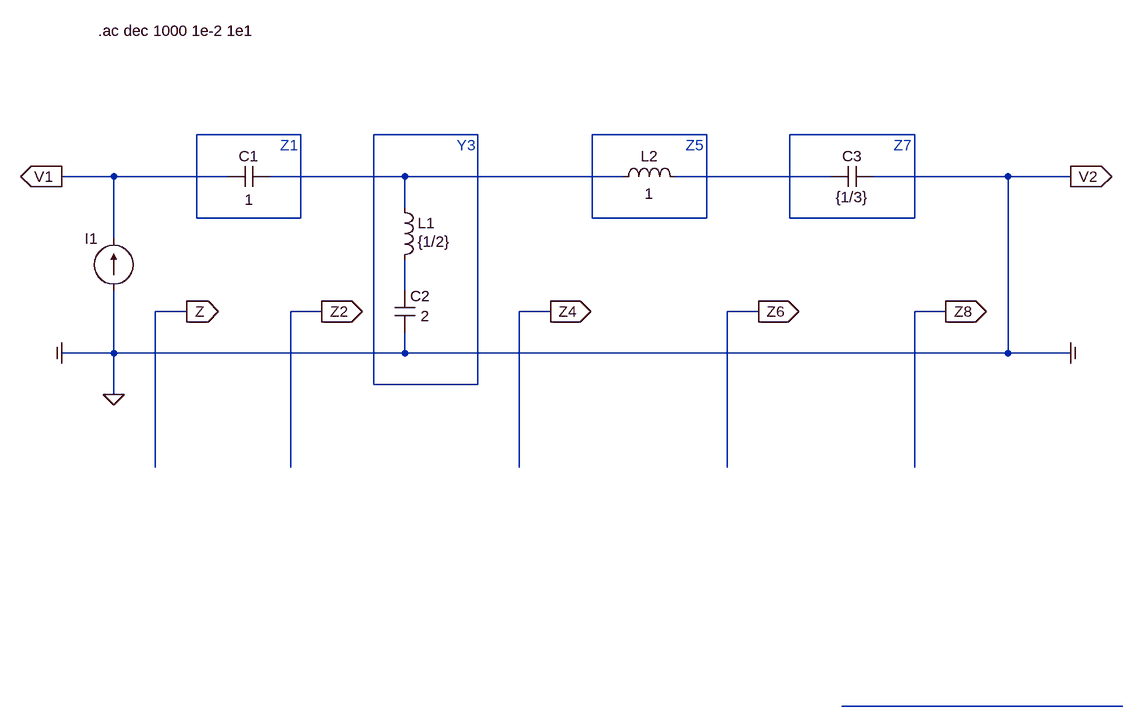
[diagram p0: schematic TS12_Ejercicio_1_LTSpice_Remociones.asc]
TS12_Ejercicio_1_LTSpice_Remociones.asc, the LTspice schematic file:
Version 4
SHEET 1 1344 680
WIRE -320 -240 -480 -240
WIRE -48 -240 -208 -240
WIRE 304 -240 128 -240
WIRE 624 -240 432 -240
WIRE -608 -176 -688 -176
WIRE -432 -176 -608 -176
WIRE -160 -176 -368 -176
WIRE 176 -176 -160 -176
WIRE 496 -176 256 -176
WIRE 768 -176 560 -176
WIRE 864 -176 768 -176
WIRE -160 -128 -160 -176
WIRE -480 -112 -480 -240
WIRE -320 -112 -320 -240
WIRE -320 -112 -480 -112
WIRE 128 -112 128 -240
WIRE 304 -112 304 -240
WIRE 304 -112 128 -112
WIRE 432 -112 432 -240
WIRE 624 -112 624 -240
WIRE 624 -112 432 -112
WIRE -608 -80 -608 -176
WIRE -160 0 -160 -48
WIRE -496 32 -544 32
WIRE -288 32 -336 32
WIRE 64 32 16 32
WIRE 384 32 336 32
WIRE 672 32 624 32
WIRE -608 96 -608 0
WIRE -608 96 -688 96
WIRE -160 96 -160 64
WIRE -160 96 -608 96
WIRE 768 96 768 -176
WIRE 768 96 -160 96
WIRE 864 96 768 96
WIRE -208 144 -208 -240
WIRE -48 144 -48 -240
WIRE -48 144 -208 144
WIRE -608 160 -608 96
WIRE -544 272 -544 32
WIRE -336 272 -336 32
WIRE 16 272 16 32
WIRE 336 272 336 32
WIRE 624 272 624 32
WIRE 944 640 512 640
FLAG 864 -176 V2
IOPIN 864 -176 Out
FLAG -688 -176 V1
IOPIN -688 -176 Out
FLAG -608 160 0
FLAG -688 96 COM
IOPIN -688 96 Out
FLAG 864 96 COM
IOPIN 864 96 Out
FLAG -496 32 Z
IOPIN -496 32 Out
FLAG -288 32 Z2
IOPIN -288 32 Out
FLAG 64 32 Z4
IOPIN 64 32 Out
FLAG 384 32 Z6
IOPIN 384 32 Out
FLAG 672 32 Z8
IOPIN 672 32 Out
SYMBOL cap -368 -192 R90
WINDOW 0 0 32 VBottom 2
WINDOW 3 67 32 VBottom 2
SYMATTR InstName C1
SYMATTR Value 1
SYMBOL cap -176 0 R0
WINDOW 3 40 39 Left 2
SYMATTR Value 2
SYMATTR InstName C2
SYMBOL ind -176 -144 R0
WINDOW 3 36 68 Left 2
SYMATTR Value {1/2}
SYMATTR InstName L1
SYMBOL ind 160 -160 R270
WINDOW 0 32 56 VTop 2
WINDOW 3 5 56 VBottom 2
SYMATTR InstName L2
SYMATTR Value 1
SYMBOL cap 560 -192 R90
WINDOW 0 0 32 VBottom 2
WINDOW 3 32 32 VTop 2
SYMATTR InstName C3
SYMATTR Value {1/3}
SYMBOL current -608 0 R180
WINDOW 0 24 80 Left 2
WINDOW 3 24 0 Left 2
WINDOW 39 0 0 Left 0
SYMATTR InstName I1
SYMATTR Value ""
SYMATTR Value2 AC 1 0
TEXT -632 -400 Left 2 !.ac dec 1000 1e-2 1e1
TEXT -80 -224 Left 2 ;Y3
TEXT -352 -224 Left 2 ;Z1
TEXT 272 -224 Left 2 ;Z5
TEXT 592 -224 Left 2 ;Z7

The netlist it stands for:
* TS12_Ejercicio_1_LTSpice_Remociones.asc
C1 N005 V1 1
C2 N007 0 2
L1 N005 N007 {1/2}
L2 N005 N006 1
C3 0 N006 {1/3}
I1 0 V1 AC 1 0
.ac dec 1000 1e-2 1e1
* Y3
* Z1
* Z5
* Z7
.backanno
.end